# EAGLE design rapport (EAGLE 9.2.1)
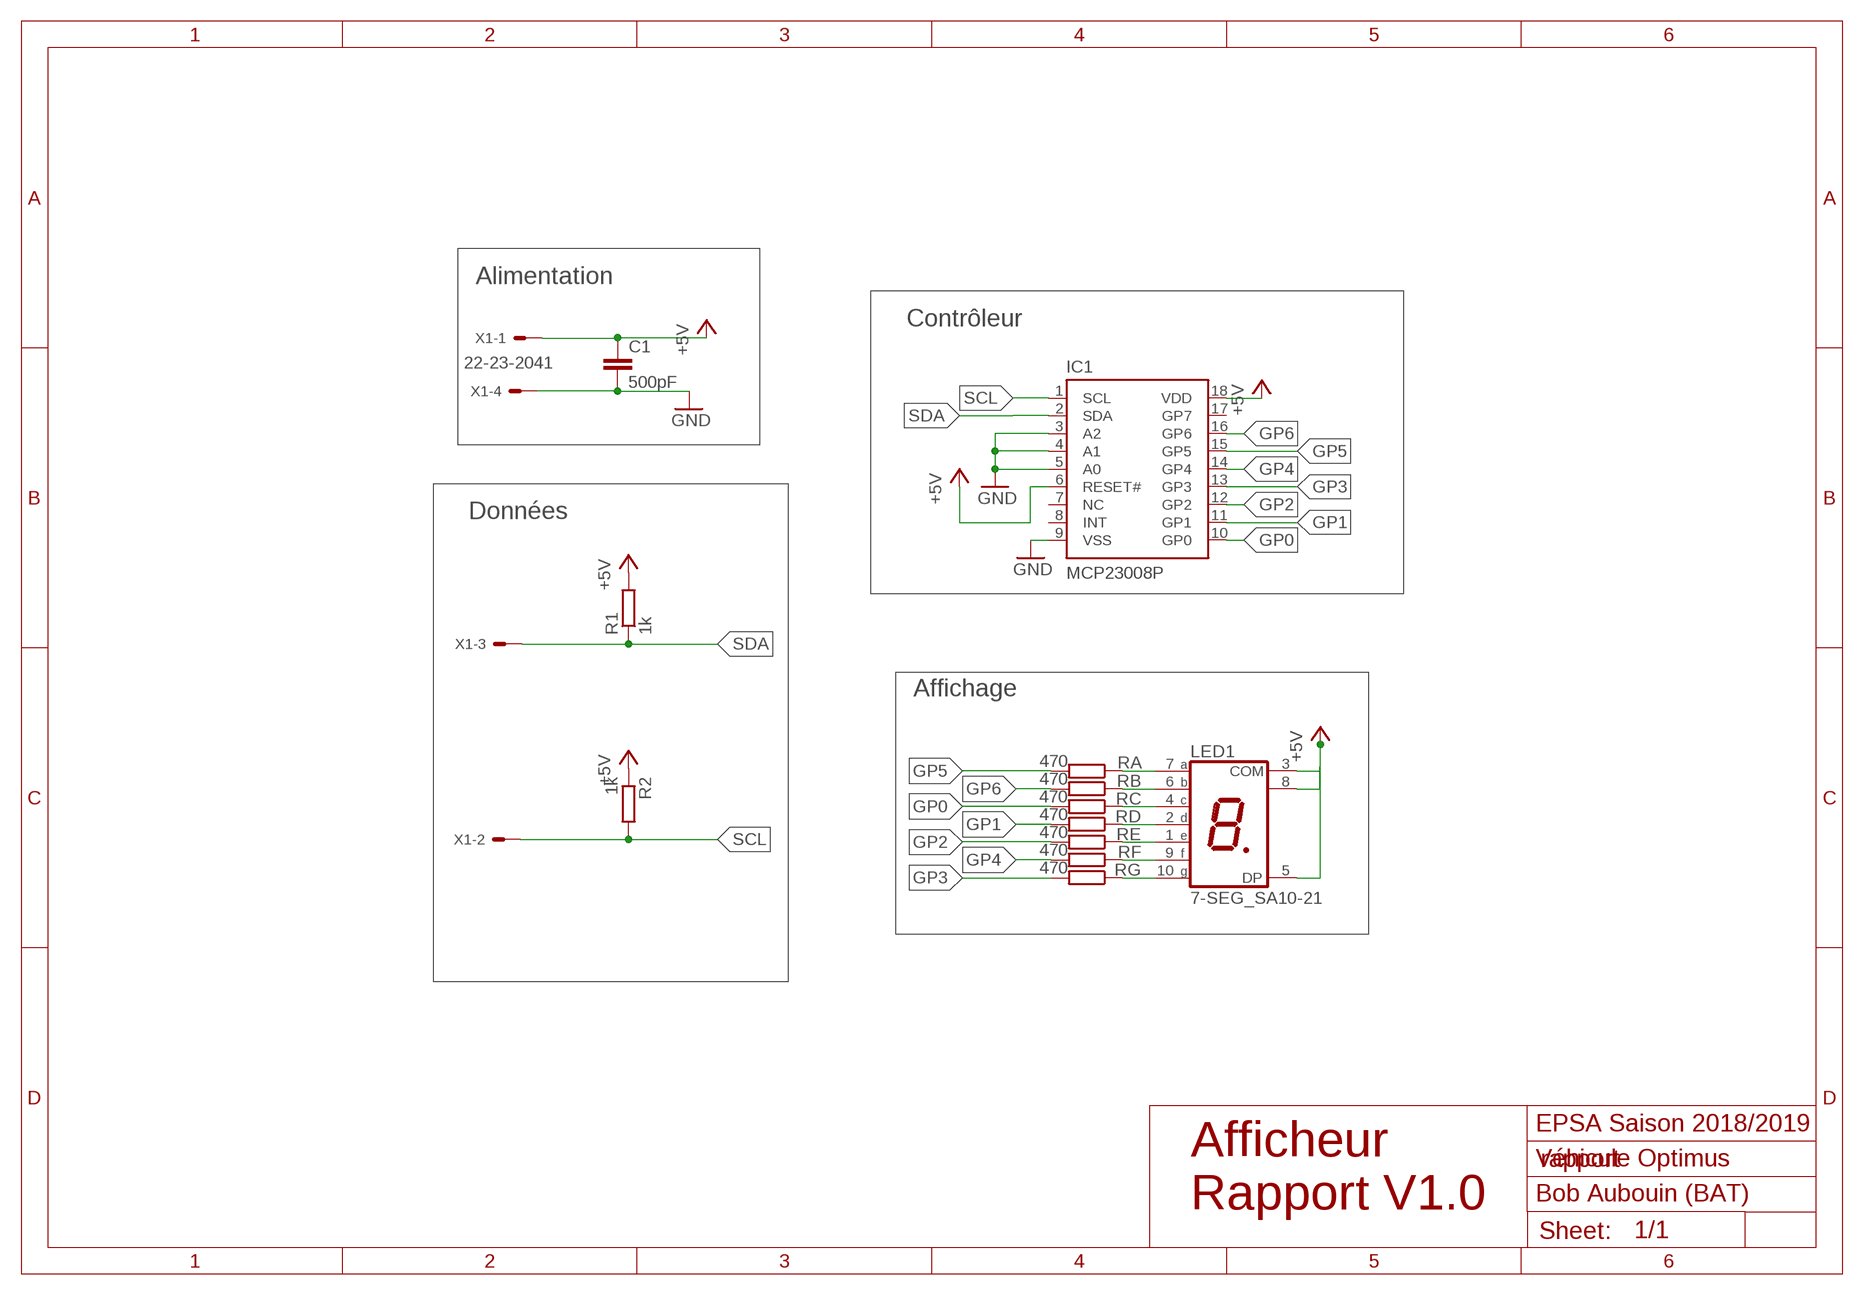
[diagram p0: schematic, sheet 1]

## Parts
C1  500pF  C-EU025-025X050  [C025-025X050]
IC1  MCP23008P  [DIL18]
LED1  7-SEG_SA10-21  [SA10-21]
R1  1k  R-EU_0204/7  [0204/7]
R2  1k  R-EU_0204/7  [0204/7]
RA  470  R-EU_0204/7  [0204/7]
RB  470  R-EU_0204/7  [0204/7]
RC  470  R-EU_0204/7  [0204/7]
RD  470  R-EU_0204/7  [0204/7]
RE  470  R-EU_0204/7  [0204/7]
RF  470  R-EU_0204/7  [0204/7]
RG  470  R-EU_0204/7  [0204/7]
X1  22-23-2041  [22-23-2041]

## Nets
+5V: C1.1 IC1.6(RESET#) IC1.18(VDD) LED1.3(COM) LED1.5(DP) LED1.8(COM) R1.2 R2.1 X1.1
GND: C1.2 IC1.3(A2) IC1.4(A1) IC1.5(A0) IC1.9(VSS) X1.4
GP0: IC1.10(GP0) RC.2
GP1: IC1.11(GP1) RD.2
GP2: IC1.12(GP2) RE.2
GP3: IC1.13(GP3) RG.2
GP4: IC1.14(GP4) RF.2
GP5: IC1.15(GP5) RA.2
GP6: IC1.16(GP6) RB.2
N$10: LED1.10(G) RG.1
N$11: LED1.9(F) RF.1
N$12: LED1.1(E) RE.1
N$13: LED1.2(D) RD.1
N$14: LED1.4(C) RC.1
N$15: LED1.6(B) RB.1
N$16: LED1.7(A) RA.1
SCL: IC1.1(SCL) R2.2 X1.2
SDA: IC1.2(SDA) R1.1 X1.3
Unconnected: IC1.7(NC) IC1.8(INT) IC1.17(GP7)

## Notes on the sheet
- Alimentation
- Contrôleur
- Données
- Affichage
- EPSA Saison 2018/2019
- Véhicule Optimus
- Bob Aubouin (BAT)
- Afficheur 
  Rapport V1.0

## Library data of the parts
C1 = rcl:C-EU: CAPACITOR, European symbol; SPICEPREFIX: C
IC1 = microchip-dspic:MCP23008: 8-Bit I/O Expander with I2C Interface
LED1 = display-kingbright:7-SEG_: Kingbright 14.2mm (0.56 INCH) SINGLE DIGIT NUMERIC DUISPLAY Source: SA56-11EWA(Ver1189471036.pdf; OC_FARNELL: unknown; OC_NEWARK: unknown
R1 R2 RA RB RC RD RE RF RG = rcl:R-EU_: RESISTOR, European symbol; SPICEPREFIX: R
X1 = con-molex:22-23-2041: .100" (2.54mm) Center Header - 4 Pin; MF: MOLEX; MPN: 22-23-2041; OC_FARNELL: 1462920; OC_NEWARK: 38C0355

## Board
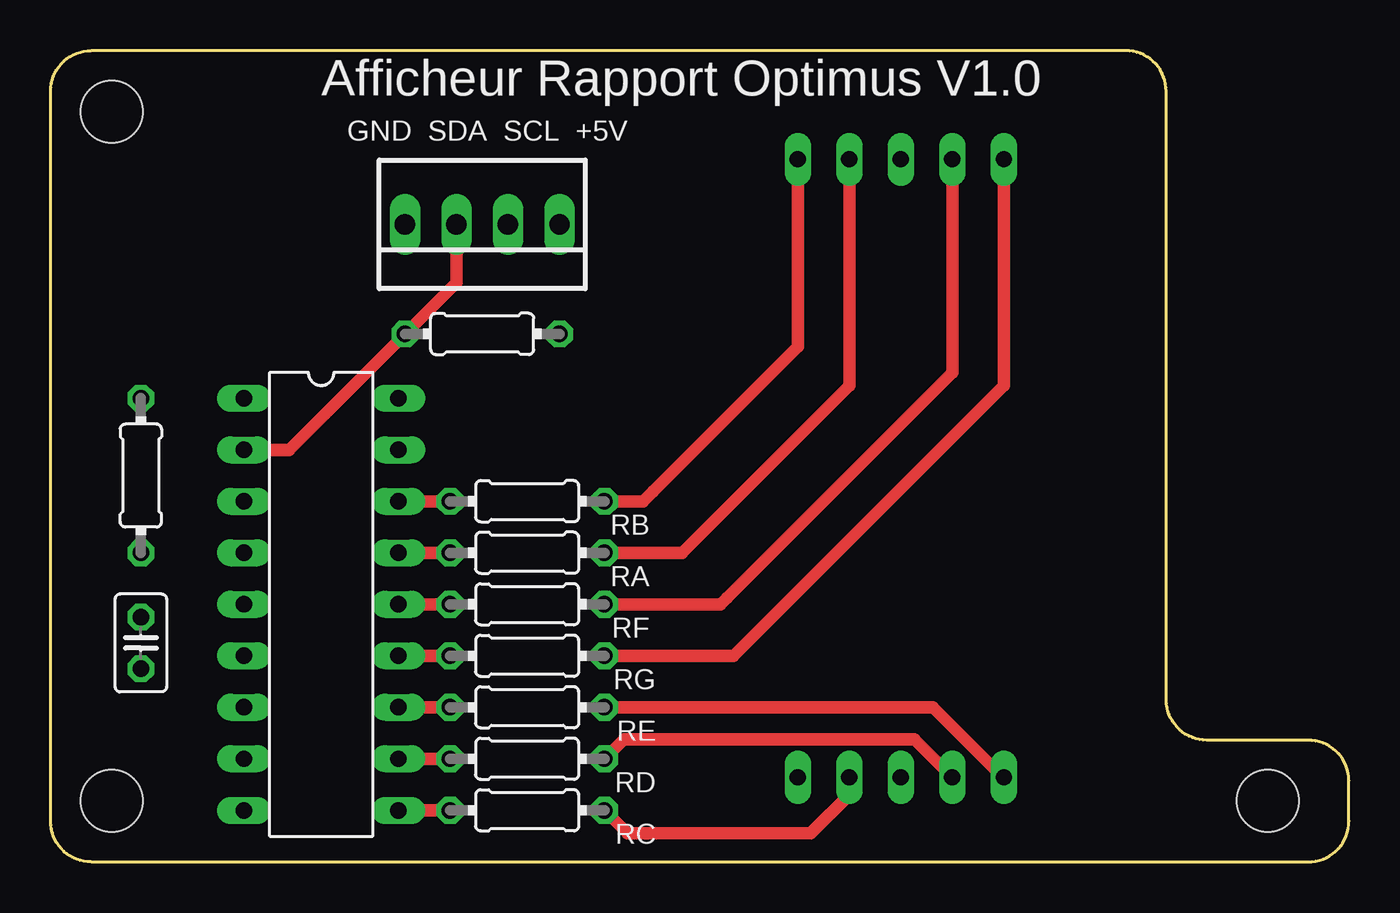
[diagram p1: board, top side]
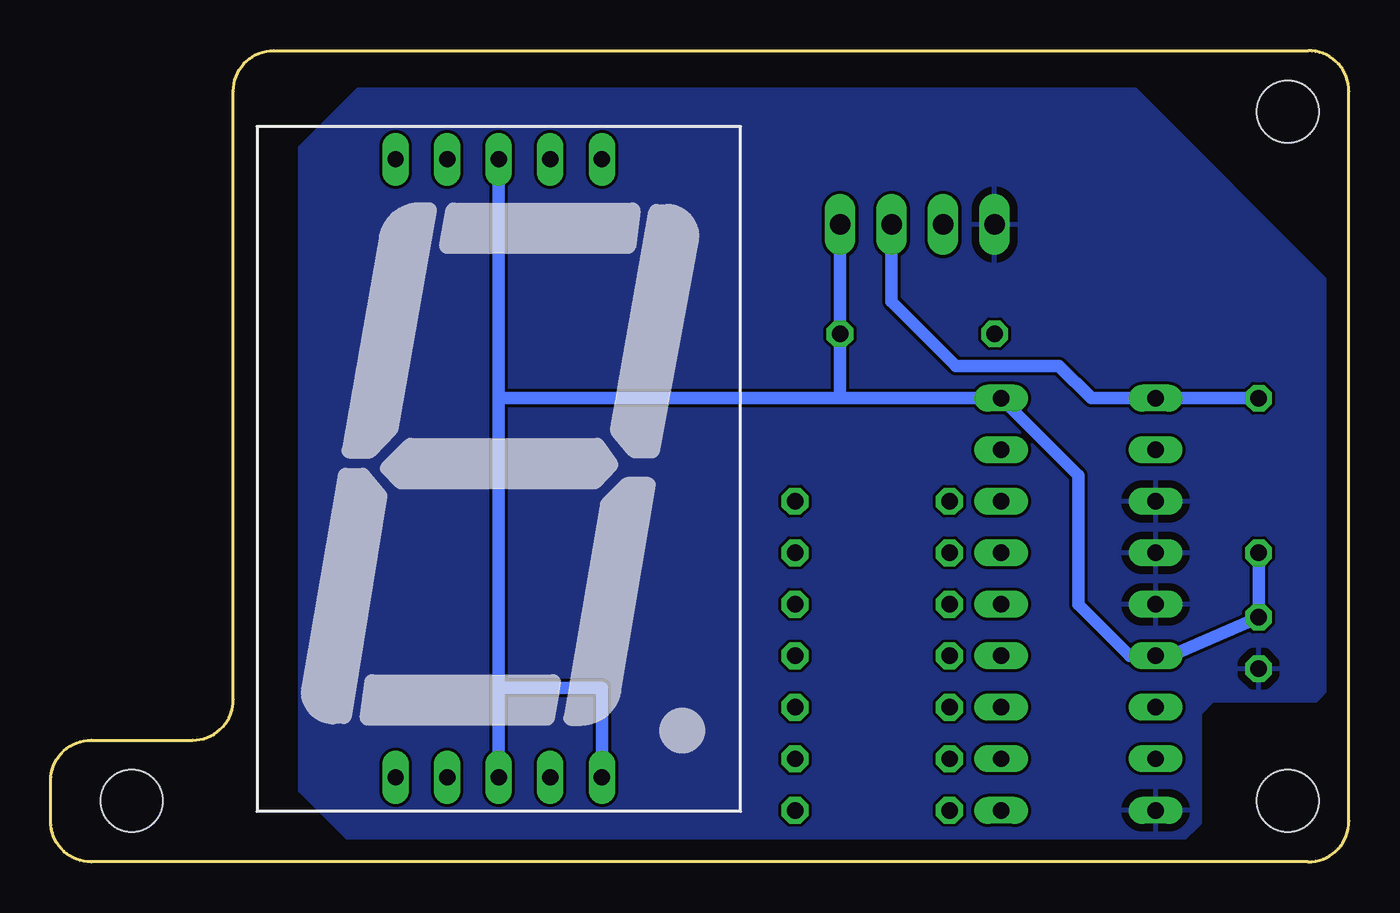
[diagram p2: board, bottom side, seen from below]

Size 64 x 40 mm. Coordinates in mm from the lower left corner, seen from the top.
Outline: 55,38 arc90 53,40 2,40 arc90 0,38 0,2 arc90 2,0 62,0 arc90 64,2 64,4 arc90 62,6 57,6 arc-90 55,8 55,38
Copper layers (1*16): Top 0.035mm / dielectric 1.5mm / Bottom 0.035mm
Design rules "default *": minimum track width 6mil, minimum drill 0.35mm, track to track 6mil, track to pad 6mil, pad to pad 6mil, via to via 6mil, smd to smd 6mil, copper to edge 40mil, drill to drill 10mil, minimum pad ring 10mil, minimum via ring 8mil, stop-mask expansion 4mil, vias tented up to drill 0mil, thermal gap 15mil
Holes 3.05 mm at 3,3 3,37 60,3

### Footprints (pad centres in the part's own frame; a part is rotated, then mirrored left to right if it is on the bottom)
C025-025X050 = drill 0.813 octagon: 1 -1.27,0; 2 1.27,0
DIL18 = drill 0.813 long: 1 -10.16,-3.81; 2 -7.62,-3.81; 3 -5.08,-3.81; 4 -2.54,-3.81; 5 0,-3.81; 6 2.54,-3.81; 7 5.08,-3.81; 8 7.62,-3.81; 9 10.16,-3.81; 10 10.16,3.81; 11 7.62,3.81; 12 5.08,3.81; 13 2.54,3.81; 14 0,3.81; 15 -2.54,3.81; 16 -5.08,3.81; 17 -7.62,3.81; 18 -10.16,3.81
SA10-21 = drill 0.8 long: 1 -5.08,-15.2; 2 -2.54,-15.2; 3 0,-15.2; 4 2.54,-15.2; 5 5.08,-15.2; 6 5.08,15.28; 7 2.54,15.28; 8 0,15.28; 9 -2.54,15.28; 10 -5.08,15.28
0204/7 = drill 0.813 octagon: 1 -3.81,0; 2 3.81,0
22-23-2041 = drill 1 long: 1 -3.81,0; 2 -1.27,0; 3 1.27,0; 4 3.81,0

### Placement (x,y rotation side)
C1  4.45,10.79 270 top
IC1  13.34,12.7 270 top
LED1  41.91,19.37 0 bottom
R1  21.27,26.04 0 top
R2  4.45,19.05 90 top
RA  23.5,15.24 180 top
RB  23.5,17.78 180 top
RC  23.5,2.54 180 top
RD  23.5,5.08 180 top
RE  23.5,7.62 180 top
RF  23.5,12.7 180 top
RG  23.5,10.16 180 top
X1  21.27,31.43 180 top

### Tracks (layer width: path | path; a pad name or v marks a point on that pad's centre or on a via)
+5V
  Bottom 0.152: IC1.18 17.46,22.86
  Bottom 0.61: 17.46,22.86 25.08,22.86 | X1.1 R1.2 25.08,22.86 | IC1.18 13.34,19.05 13.34,12.7 10.79,10.16 IC1.6 8.8,10.16 C1.1 R2.1 | LED1.8 41.91,22.86 | 41.91,22.86 41.91,8.57 | 41.91,8.57 LED1.3 | 41.91,8.57 36.83,8.57 LED1.5 | 25.08,22.86 41.91,22.86
GND
  pour Bottom: 1.59,7.94 0.95,8.57 0.95,28.57 10.48,38.1 48.9,38.1 51.75,35.24 51.75,3.49 49.21,0.95 8.26,0.95 7.3,1.91 7.3,6.67 7.3,7.3 6.67,7.94
GP0
  Top 0.61: IC1.10 RC.2
GP1
  Top 0.61: IC1.11 RD.2
GP2
  Top 0.61: IC1.12 RE.2
GP3
  Top 0.61: IC1.13 RG.2
GP4
  Top 0.61: IC1.14 RF.2
GP5
  Top 0.61: IC1.15 RA.2
GP6
  Top 0.61: IC1.16 RB.2
N$10
  Top 0.61: LED1.10 46.99,23.5 33.66,10.16 RG.1
N$11
  Top 0.61: LED1.9 44.45,24.13 33.34,13.02 33.02,12.7 RF.1
N$12
  Top 0.152: LED1.1 46.95,4.17
  Top 0.61: 46.95,4.17 43.5,7.62 RE.1
N$13
  Top 0.61: RD.1 28.26,6.03 42.59,6.03 LED1.2
N$14
  Top 0.61: RC.1 28.45,1.4 37.47,1.4 39.37,3.3 LED1.4
N$15
  Top 0.61: RB.1 29.21,17.78 29.69,18.26 36.83,25.4 LED1.6
N$16
  Top 0.61: RA.1 31.11,15.24 39.37,23.5 LED1.7
SCL
  Bottom 0.61: X1.2 22.54,27.62 19.37,24.45 14.29,24.45 12.7,22.86 IC1.1 R2.2
SDA
  Top 0.61: IC1.2 11.75,20.32 R1.1 20,28.57 X1.3

### Text on the board
tPlace: Afficheur Rapport Optimus V1.0 | GND SDA SCL +5V